# EAGLE design attinier85-motherboard-mk-3.1 (EAGLE 6.5.0)
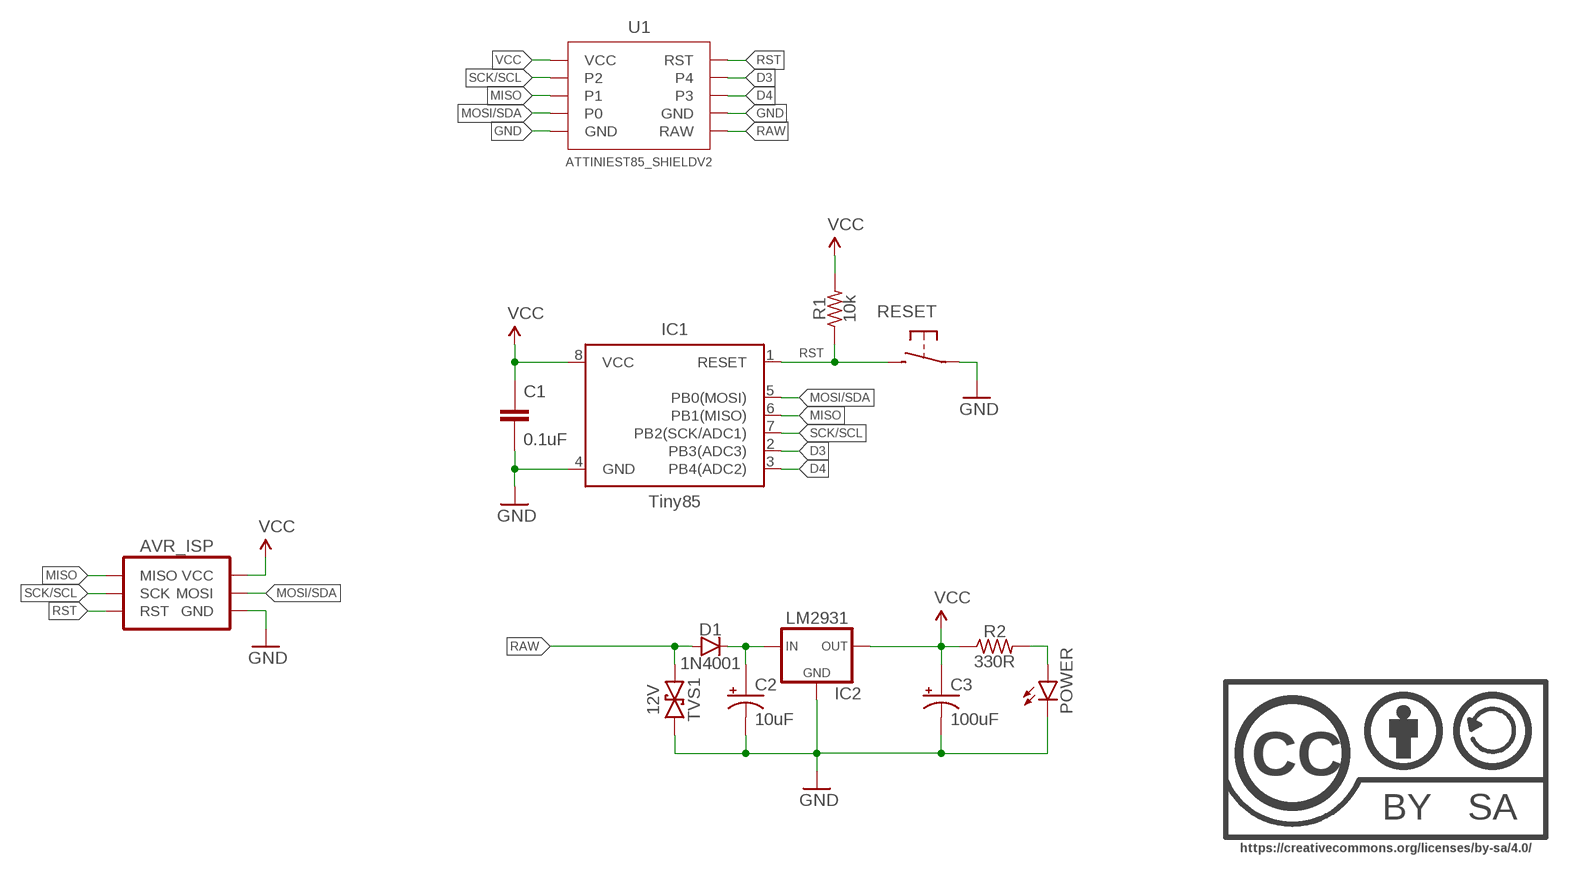
[diagram p0: schematic, sheet 1]

## Parts
AVR_ISP  AVR_SPI_PRG_6PTH  [2X3]
C1  0.1uF  CAPACITOR-CERAMIC025-024X044  [C025-024X044]
C2  10uF  CAPACITOR-POLARIZEDE2.5-5  [E2,5-5]
C3  100uF  CAPACITOR-POLARIZEDE2.5-5  [E2,5-5]
D1  1N4001  DIODEPTH-10.68MM  [DIODE-10.16MM]
IC1  Tiny85  ATTINY45TINY85-20-DIP  [DIP08]
IC2  LM2931  V_REG_78XXTO-92-INLINE  [TO-92-AMMO]
POWER  LED3MM-LESS  [LED3MM-LESSSILK]
R1  10k  RESISTORPTH-AXIAL-7.62MM  [RESISTOR-AXIAL-PTH-7.62MM]
R2  330R  RESISTORPTH-AXIAL-7.62MM  [RESISTOR-AXIAL-PTH-7.62MM]
RESET  DTS-6MM  SPST-NO-TACT3MM-PTH-SMALL-PADS  [DTS-3-SMALL-PADS]
TVS1  12V  TVSDO-41-TVS-BIDIRECTIONAL  [DO-41-TVS]
U1  ATTINIEST85_SHIELDV2  [ATTINIEST85_SHIELD_V2]
U$1  CC-BY-SA-4.0NO-URL  [CC-BY-SA-4.0-NO-URL]

## Nets
D3: IC1.2(PB3(ADC3)) U1.4
D4: IC1.3(PB4(ADC2)) U1.3
GND: AVR_ISP.6(GND) C1.2 C2.- C3.- IC1.4(GND) IC2.2(GND) POWER.K(C) RESET.1 TVS1.P$2 U1.GND@1(GND) U1.GND@2(GND)
MISO: AVR_ISP.1(MISO) IC1.6(PB1(MISO)) U1.1
MOSI/SDA: AVR_ISP.4(MOSI) IC1.5(PB0(MOSI)) U1.0
N$3: C2.+ D1.C IC2.1(IN)
N$7: POWER.A R2.P$2
RAW: D1.A TVS1.P$1 U1.RAW
RST: AVR_ISP.5(RST) IC1.1(RESET) R1.P$1 RESET.2 U1.RST
SCK/SCL: AVR_ISP.3(SCK) IC1.7(PB2(SCK/ADC1)) U1.2
VCC: AVR_ISP.2(VCC) C1.1 C3.+ IC1.8(VCC) IC2.3(OUT) R1.P$2 R2.P$1 U1.VCC

## Library data of the parts
AVR_ISP = A_butts:AVR_SPI_PRG_6: AVR ISP 6 Pin This is the reduced ISP connector for AVR programming. Common on Arduino. This footprint will take up less PCB space and can be used with a 10-pin to 6-pin adapter such as SKU: BOB-08508 **Special note about "TEST_POINT" package. The stop mask is on the top side, so if you want your programming test points to be on the bottom of your board, make sure to place this package on the bottom side of the board. This also ensure that the orientation to program from the bottom side will be correct.
C1 = A_butts:CAPACITOR-CERAMIC: CAPACITOR, European symbol
C2 C3 = A_butts:CAPACITOR-POLARIZED: POLARIZED CAPACITOR, American symbol
D1 = A_butts:DIODE: Diode These are standard reverse protection diodes and small signal diodes. SMA package can handle up to about 1A. SOD-323 can handle about 200mA. What the SOD-323 package when ordering, there are some mfgs out there that are 5-pin packages.
IC1 = A_butts:ATTINY45: Atmel 8-pin 2/4/8kB flash uC; PROD_ID: IC-09445; VALUE: TINY85-20-DIP
IC2 = A_butts:V_REG_78XX: Voltage Regulator Standard 7805 5V regulator. IGO (Input Ground Output). Spark Fun Electronics SKU : COM-00107
POWER = A_butts:LED: LEDs Standard schematic elements and footprints for 5mm, 3mm, 1206, and 0603 sized LEDs. 5mm - Spark Fun Electronics SKU : COM-00529 (and others)
R1 R2 = A_butts:RESISTOR: RESISTOR, American symbol
RESET = A_butts:SPST-NO-TACT
TVS1 = A_butts:TVS: Transient voltage suppressor- prevents ESD on inputs. Ignore package description- MBRA140 is NOT this type of part!!!
U1 = A_butts:ATTINIEST85_SHIELD
U$1 = A_butts:CC-BY-SA-4.0

## Board
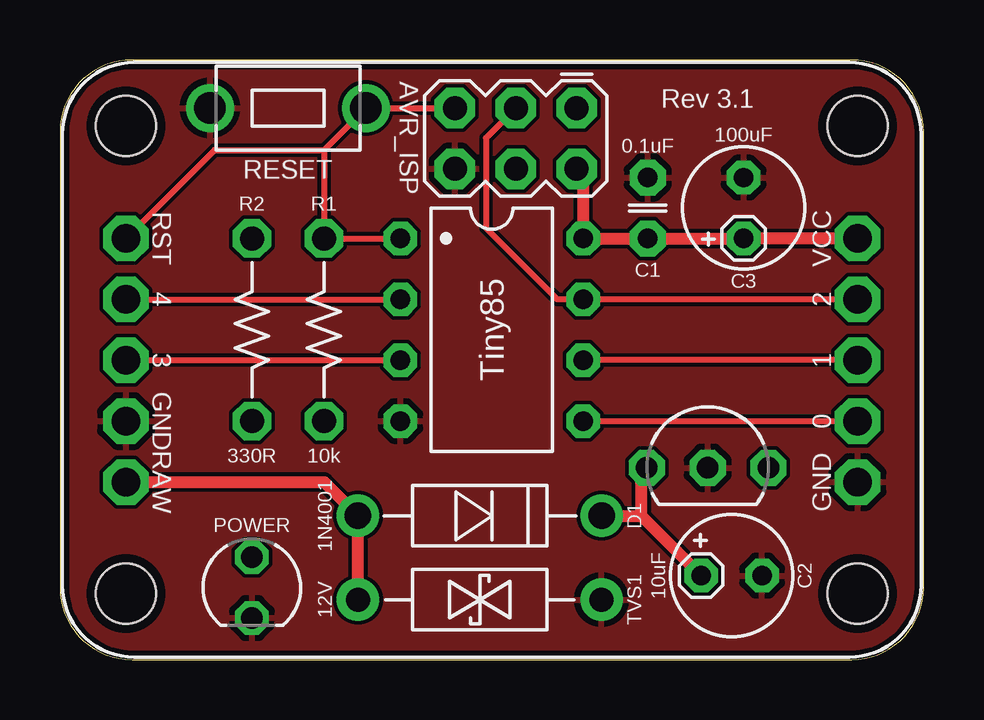
[diagram p1: board, top side]
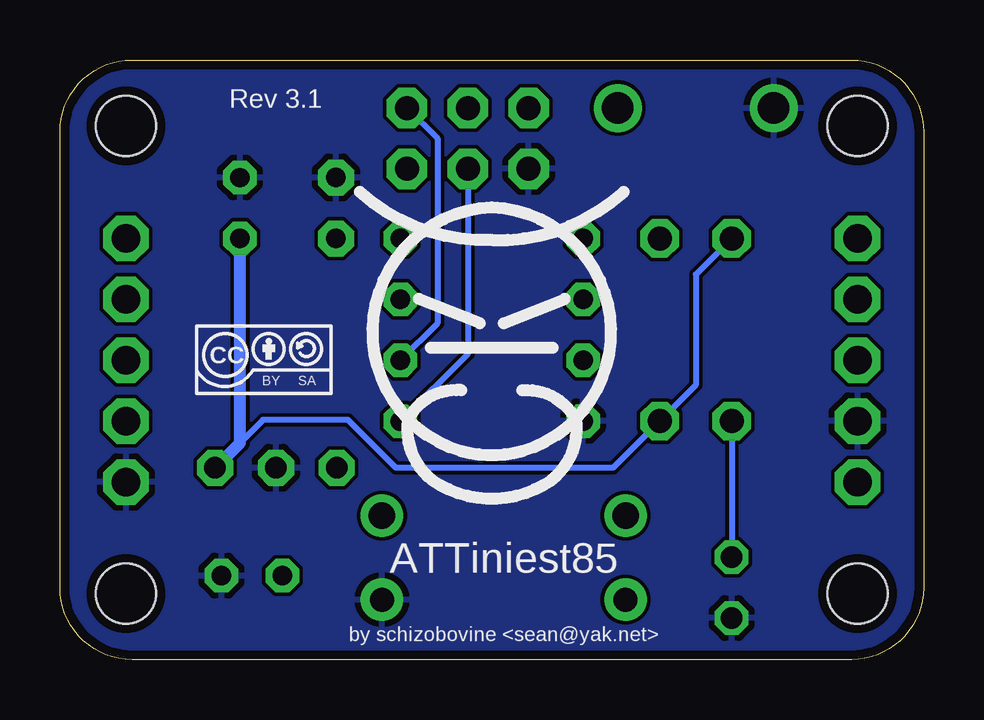
[diagram p2: board, bottom side, seen from below]

Size 36 x 25 mm. Coordinates in mm from the lower left corner, seen from the top.
Outline: 0,22 0,3 arc90 3,0 33,0 arc90 36,3 36,22 arc90 33,25 3,25 arc90 0,22
Copper layers (1*16): Top 0.0356mm / dielectric 1.5011mm / Bottom 0.0356mm
Design rules "LaenPCBOrder2": minimum track width 6mil, minimum drill 13mil, track to track 6mil, track to pad 6mil, pad to pad 6mil, via to via 6mil, smd to smd 6mil, copper to edge 15mil, drill to drill 6mil, minimum pad ring 7mil, minimum via ring 7mil, stop-mask expansion 3mil, vias tented up to drill 20mil, thermal gap 10mil

### Footprints (pad centres in the part's own frame; a part is rotated, then mirrored left to right if it is on the bottom)
2X3 = drill 1 pad 1.676 octagon: 1 -2.54,-1.27; 2 -2.54,1.27; 3 0,-1.27; 4 0,1.27; 5 2.54,-1.27; 6 2.54,1.27
C025-024X044 = drill 0.813 pad 1.5 octagon: 1 -1.27,0; 2 1.27,0
E2,5-5 = drill 0.8 pad 1.4 octagon: + -1.27,0; - 1.27,0
DIODE-10.16MM = drill 1.1 pad 1.778: A -5.08,0; C 5.08,0
DIP08 = drill 0.8 pad 1.4 octagon: 1 -3.81,-3.81; 2 -1.27,-3.81; 3 1.27,-3.81; 4 3.81,-3.81; 5 3.81,3.81; 6 1.27,3.81; 7 -1.27,3.81; 8 -3.81,3.81
TO-92-AMMO = drill 0.9 pad 1.5 octagon: 1 -2.54,0; 2 0,0; 3 2.54,0
LED3MM-LESSSILK = drill 0.9 pad 1.4 octagon: A -1.27,0; K 1.27,0
RESISTOR-AXIAL-PTH-7.62MM = drill 1 pad 1.6 octagon: P$1 -3.81,0; P$2 3.81,0
DTS-3-SMALL-PADS = drill 1.3 pad 2: 1 -3.25,0; 2 3.25,0
DO-41-TVS = drill 1 pad 1.778: P$1 -5.08,0; P$2 5.08,0
ATTINIER85_SHIELD_V2 = drill 1.2 pad 1.9 octagon: 0 15.25,-2.56; 1 15.25,-0.02; 2 15.25,2.52; 3 -15.25,-0.02; 4 -15.25,2.52; GND@1 -15.25,-2.56; GND@2 15.25,-5.1; RAW -15.25,-5.1; RST -15.25,5.06; VCC 15.25,5.06 | hole 2.5: -15.25,-9.75; -15.25,9.75; 15.25,9.75; 15.25,-9.75

### Placement (x,y rotation side)
AVR_ISP  19,21.73 180 top
C1  24.5,18.83 90 top
C2  28,3.5 0 top
C3  28.5,18.83 90 top
D1  17.5,6 0 top
IC1  18,13.75 270 top
IC2  27,8 0 top
POWER  8,3 270 top
R1  11,13.75 270 top
R2  8,13.75 270 top
RESET  9.5,23 0 top
TVS1  17.5,2.5 0 top
U1  ATTINIER85_SHIELDV2  [ATTINIER85_SHIELD_V2]  18,12.5 0 top
U$1  27.5,12.5 0 bottom
U$2  [COW]  18,12.5 0 bottom

### Tracks (layer width: path | path; a pad name or v marks a point on that pad's centre or on a via)
D3
  Top 0.25: U1.4 IC1.2
D4
  Top 0.25: U1.3 IC1.3
GND
  pour Top: 36.1,25.1 36.1,-0.1 -0.1,-0.1 -0.1,25.1
  pour Bottom: 36.1,25.1 36.1,-0.1 -0.1,-0.1 -0.1,25.1
MISO
  Top 0.25: U1.1 IC1.6
  Bottom 0.25: AVR_ISP.1 20.27,21.73 20.27,14.02 IC1.6
MOSI/SDA
  Top 0.25: IC1.5 U1.0
  Bottom 0.25: AVR_ISP.4 19,12.75 IC1.5
N$3
  Top 0.5: D1.C 24.23,6 | 24.23,6 C2.+ | 24.23,6 24.23,7.77 IC2.1
N$7
  Bottom 0.25: R2.P$2 POWER.A
RAW
  Top 0.5: U1.RAW 11.02,7.4 D1.A TVS1.P$1
RST
  Top 0.25: U1.RST 6.44,21.25 11,21.25 | IC1.1 R1.P$1 11,21.25 | AVR_ISP.5 RESET.2 11,21.25
SCK/SCL
  Top 0.25: U1.2 IC1.7 20.73,15.02 17.75,18 17.75,21.75 AVR_ISP.3
VCC
  Top 0.5: U1.VCC C3.+ C1.1 IC1.8 21.81,20.19 AVR_ISP.2
  Bottom 0.25: R2.P$1 9.5,16.06 9.5,11.44 R1.P$2 12.94,8 22,8 24,10 27.54,10 28.5,9.04
  Bottom 0.5: IC2.3 28.5,9.04 C3.+

### Text on the board
bPlace: ATTiniest85